# Altium schematic sheet Peripheral.SchDoc
size A4
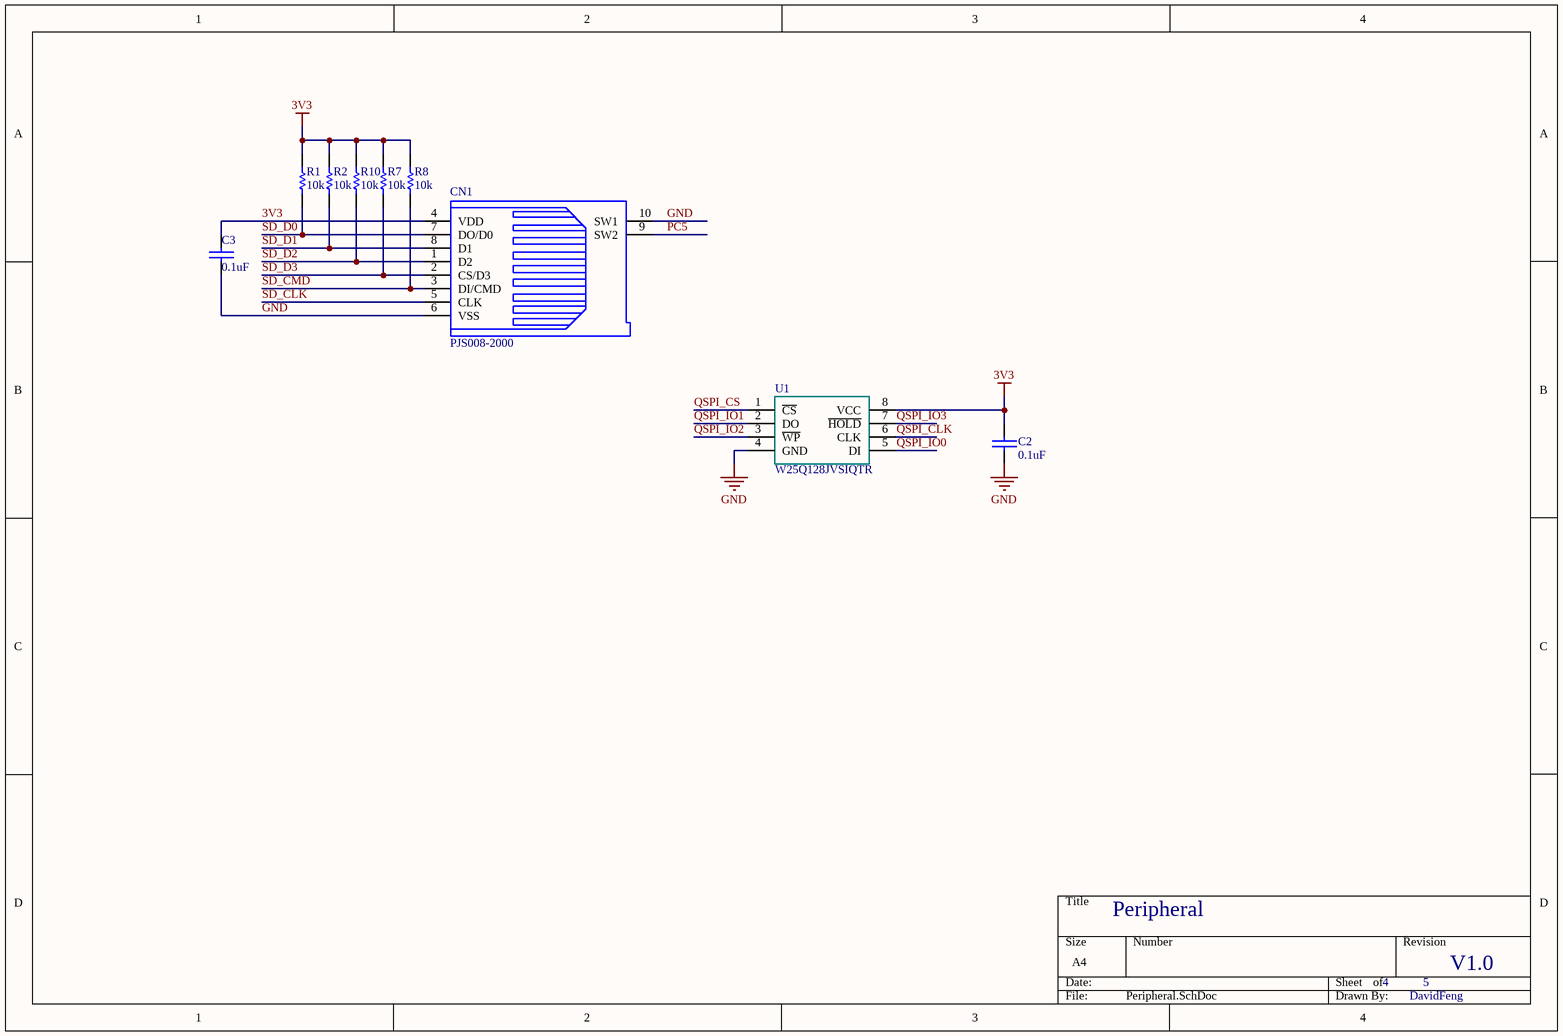
[diagram p0: Peripheral.SchDoc]

## Parts
C2  0.1uF  [c0603]
C3  0.1uF  [c0603]
CN1  PJS008-2000  [TF_CARD]
R1  10k  [R0603]
R2  10k  [R0603]
R7  10k  [R0603]
R8  10k  [R0603]
R10  10k  [R0603]
U1  W25Q128JVSIQTR  [SOIC127P800-8N]

## Nets
3V3: C2.1 C3.1 CN1.4(VDD) R1.1 R2.1 R7.1 R8.1 R10.1 U1.8(VCC)
GND: C2.2 C3.2 CN1.6(VSS) CN1.10(SW1) U1.4(GND)
PC5: CN1.9(SW2)
QSPI_CLK: U1.6(CLK)
QSPI_CS: U1.1(~{CS})
QSPI_IO0: U1.5(DI)
QSPI_IO1: U1.2(DO)
QSPI_IO2: U1.3(~{WP})
QSPI_IO3: U1.7(~{HOLD})
SD_CLK: CN1.5(CLK)
SD_CMD: CN1.3(DI/CMD) R8.2
SD_D0: CN1.7(DO/D0) R1.2
SD_D1: CN1.8(D1) R2.2
SD_D2: CN1.1(D2) R10.2
SD_D3: CN1.2(CS/D3) R7.2

## Notes on the sheet
- Peripheral
- 4
- 5
- V1.0
- DavidFeng

## Library data of the parts
C2 C3 = CAP: Capacitor
CN1 = TF_CARD
R1 R2 R7 R8 R10 = Res1: Resistor; Value: 1K; Published: 8-Jun-2000; LatestRevisionDate: 17-Jul-2002; LatestRevisionNote: Re-released for DXP Platform.; PackageReference: AXIAL-0.3; Publisher: Altium Limited
U1 = W25QXX: 64M-BIT  SERIAL FLASH MEMORY